# EAGLE board Main (EAGLE 8.0.2)
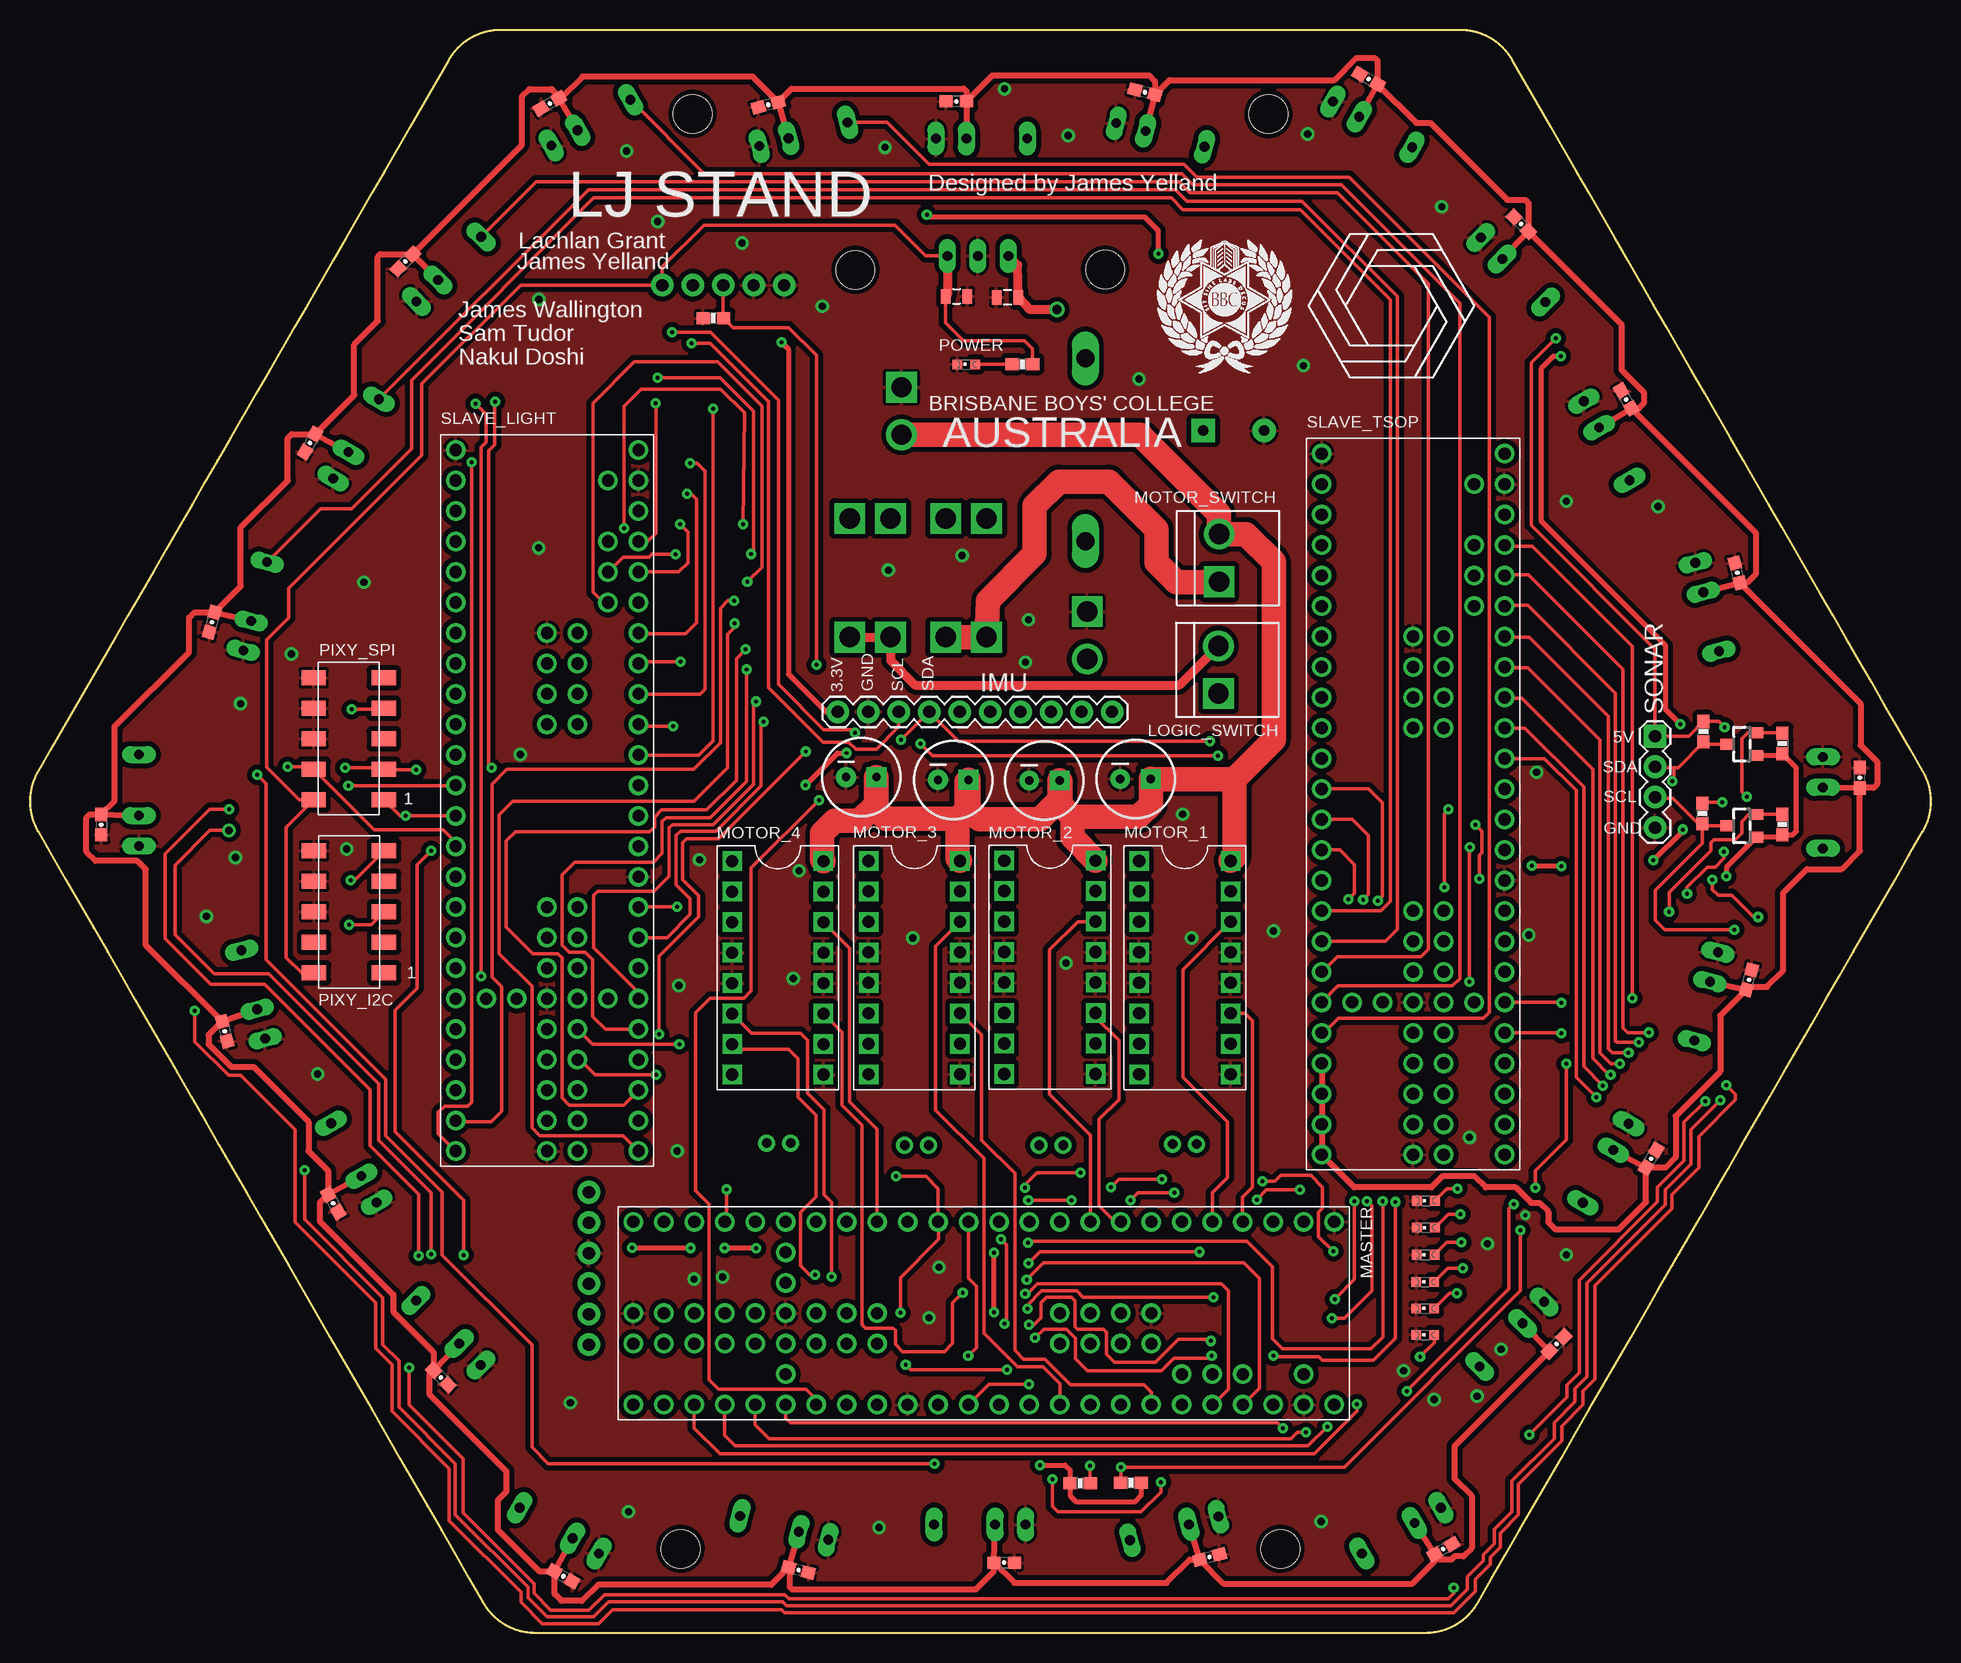
[diagram p3: board, top side]
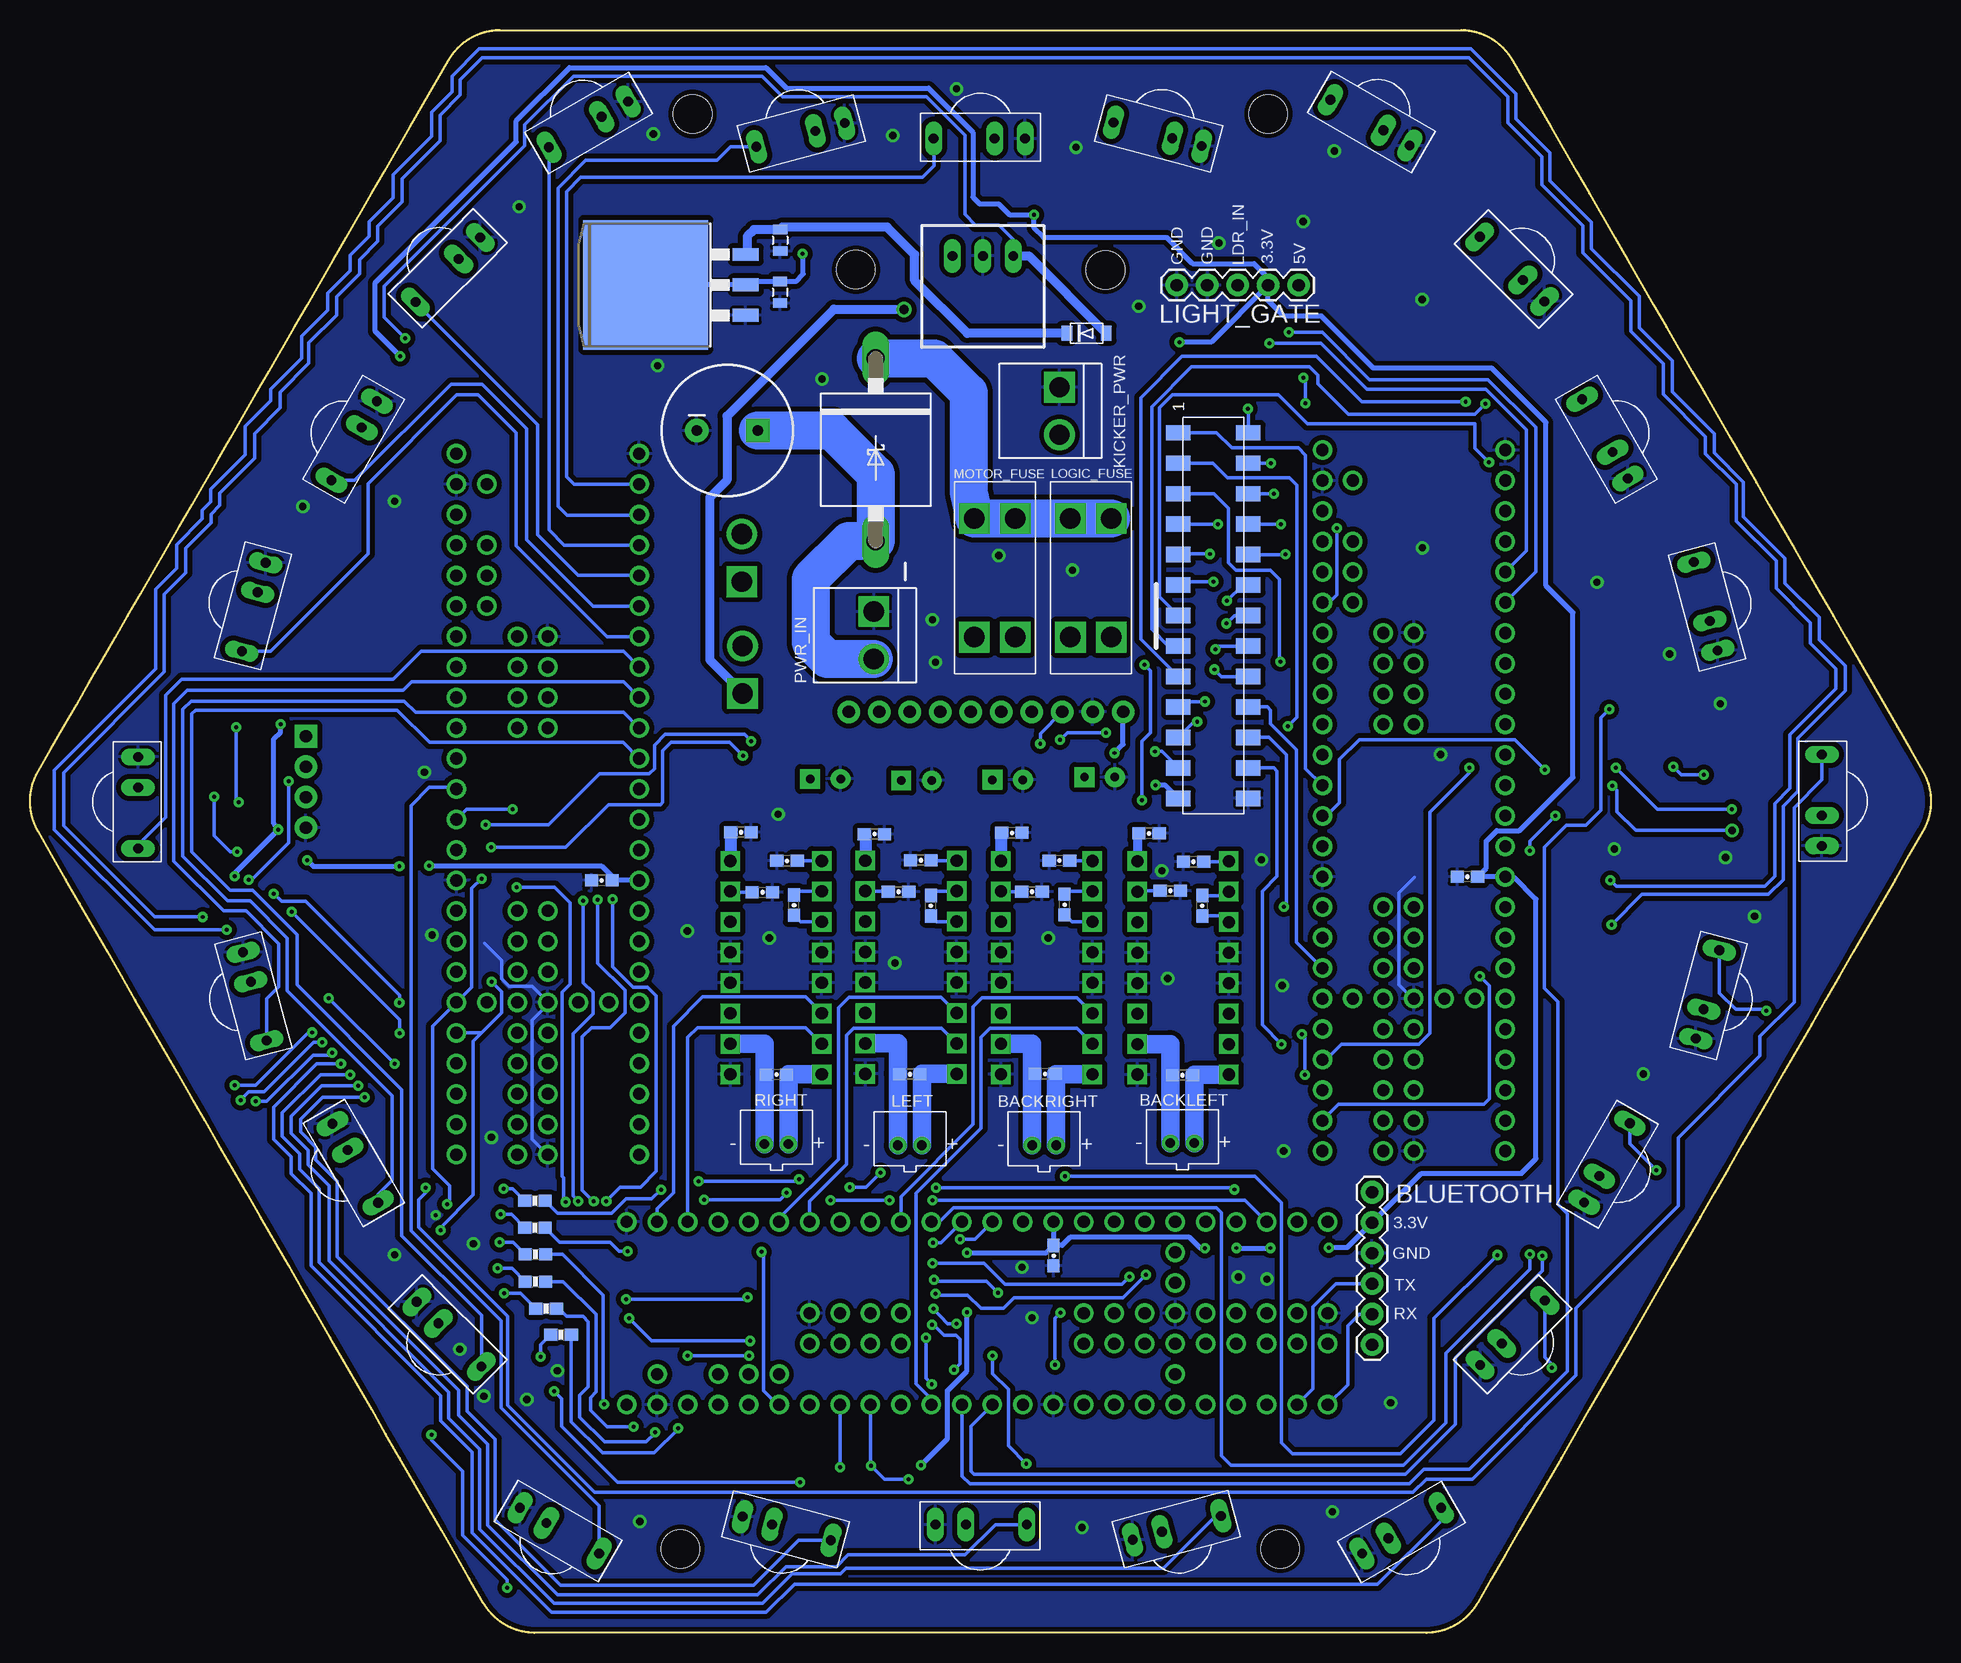
[diagram p4: board, bottom side, seen from below]

Size 158.45 x 133.56 mm. Coordinates in mm from the lower left corner, seen from the top.
Outline: 639 segments
Copper layers (1*16): Top 0.035mm / dielectric 1.5mm / Bottom 0.035mm
Design rules "SparkFun *": minimum track width 6mil, minimum drill 12mil, track to track 8mil, track to pad 8mil, pad to pad 8mil, via to via 8mil, smd to smd 8mil, copper to edge 10mil, drill to drill 8mil, minimum pad ring 12mil, minimum via ring 10mil, stop-mask expansion 4mil, vias tented up to drill 25mil, thermal gap 10mil
Holes 3.2 mm at 54.23,6.99 104.23,6.99 55.23,126.58 103.23,126.56 89.61,113.6 68.81,113.57

## Footprints (pad centres in the part's own frame; a part is rotated, then mirrored left to right if it is on the bottom)
TSOP17XX = drill 0.813 long: GND -3.81,0; OUT 3.81,0; V+ -1.27,0
JST-PH-2-THM = drill 0.8 pad 1.422: 1 1,0; 2 -1,0
1X06 = drill 1.016 pad 1.88: 1 0,0; 2 2.54,0; 3 5.08,0; 4 7.62,0; 5 10.16,0; 6 12.7,0
CPOL-RADIAL-1000UF-25V = drill 0.9 pad 1.93 square: + 2.54,0 | drill 0.9 pad 1.93: - -2.54,0
CPOL-RADIAL-100UF-25V = drill 0.7 pad 1.651 square: 1 1.27,0 | drill 0.7 pad 1.651: 2 -1.27,0
0603-CAP = smd 1.1 x 1: 1 -0.85,0; 2 0.85,0
0805 = smd 0.8 x 1.2: 1 -0.9,0; 2 0.9,0
P6T15 = drill 1.499 long: A 7.62,0; C -7.62,0
SOD-123FL = smd 0.91 x 1.22: A 1.637,0; C -1.637,0
1X10 = drill 1.016 pad 1.88: 1 0,0; 2 2.54,0; 3 5.08,0; 4 7.62,0; 5 10.16,0; 6 12.7,0; 7 15.24,0; 8 17.78,0; 9 20.32,0; 10 22.86,0
B2P-VH = drill 1.7 square: 1 -1.98,0 | drill 1.7: 2 1.98,0
CHIPLED_0603 = smd 0.8 x 0.8: A 0,-0.75; C 0,0.75
1X05 = drill 1.016 pad 1.88: 1 0,0; 2 2.54,0; 3 5.08,0; 4 7.62,0; 5 10.16,0
2X13_SMT = smd 1.27 x 2.032: 1 -15.24,-2.921; 2 -15.24,2.921; 3 -12.7,-2.921; 4 -12.7,2.921; 5 -10.16,-2.921; 6 -10.16,2.921; 7 -7.62,-2.921; 8 -7.62,2.921; 9 -5.08,-2.921; 10 -5.08,2.921; 11 -2.54,-2.921; 12 -2.54,2.921; 13 0,-2.921; 14 0,2.921; 15 2.54,-2.921; 16 2.54,2.921; 17 5.08,-2.921; 18 5.08,2.921; 19 7.62,-2.921; 20 7.62,2.921; 21 10.16,-2.921; 22 10.16,2.921; 23 12.7,-2.921; 24 12.7,2.921; 25 15.24,-2.921; 26 15.24,2.921
3568-FUSEHOLDER = drill 1.702 square: 1 0,3.404; 2 0,0; 3 9.906,0; 4 9.906,3.404
TEENSY-3.5 = drill 1.016: 0 -7.62,26.67; 1 -7.62,24.13; 2 -7.62,21.59; 3 -7.62,19.05; 3.3V -7.62,-6.35; 3.3V-1 7.62,24.13; 3.3V-2 2.54,-29.21; 3.3V-3 -2.54,-16.51; 4 -7.62,16.51; 5 -7.62,13.97; 6 -7.62,11.43; 7 -7.62,8.89; 8 -7.62,6.35; 9 -7.62,3.81; 10 -7.62,1.27; 11 -7.62,-1.27; 12 -7.62,-3.81; 13 7.62,-3.81; 14 7.62,-1.27; 15 7.62,1.27; 16 7.62,3.81; 17 7.62,6.35; 18 7.62,8.89; 19 7.62,11.43; 20 7.62,13.97; 21 7.62,16.51; 22 7.62,19.05; 23 7.62,21.59; 24 -7.62,-8.89; 25 -7.62,-11.43; 26 -7.62,-13.97; 27 -7.62,-16.51; 28 -7.62,-19.05; 29 -7.62,-21.59; 30 -7.62,-24.13; 31 -7.62,-26.67; 32 -7.62,-29.21; 33 7.62,-29.21; 34 7.62,-26.67; 35 7.62,-24.13; 36 7.62,-21.59; 37 7.62,-19.05; 38 7.62,-16.51; 39 7.62,-13.97; 40 0,-8.89; 41 0,-11.43; 42 0,-13.97; 43 0,-19.05; 44 0,-21.59; 45 0,-24.13; 46 0,-26.67; 47 2.54,-26.67; 48 2.54,-24.13; 49 2.54,-21.59; 50 2.54,-19.05; 51 2.54,-13.97; 52 2.54,-11.43; 53 2.54,-8.89; 54 2.54,6.35; 55 2.54,8.89; 56 2.54,11.43; 57 2.54,13.97; A10 5.08,19.05; A11 5.08,16.51; AGND 7.62,26.67; AREF 5.08,21.59; DA0 7.62,-11.43; DA1 7.62,-8.89; DC 0,8.89; DD 0,6.35; DE 0,11.43; GND -7.62,29.21; GND-1 7.62,-6.35; GND-2 0,-29.21; GND-3 0,-16.51; GND-4 0,13.97; PRGRM 2.54,-16.51; RESET 5.08,-16.51; VBAT -5.08,-16.51; VIN 7.62,29.21; VUSB 5.08,26.67
TB6549PG = drill 1.016 square: 1 -3.81,8.89; 2 -3.81,6.35; 3 -3.81,3.81; 4 -3.81,1.27; 5 -3.81,-1.27; 6 -3.81,-3.81; 7 -3.81,-6.35; 8 -3.81,-8.89; 9 3.81,-8.89; 10 3.81,-6.35; 11 3.81,-3.81; 12 3.81,-1.27; 13 3.81,1.27; 14 3.81,3.81; 15 3.81,6.35; 16 3.81,8.89
2X05_SMT = smd 1.27 x 2.032: 1 -5.08,-2.921; 2 -5.08,2.921; 3 -2.54,-2.921; 4 -2.54,2.921; 5 0,-2.921; 6 0,2.921; 7 2.54,-2.921; 8 2.54,2.921; 9 5.08,-2.921; 10 5.08,2.921
0603-RES = smd 1.1 x 1: 1 -0.85,0; 2 0.85,0
SOT23 = smd 0.9 x 1.2: 1 -0.95,-1.2; 2 0.95,-1.2; 3 0,1.2
1X04 = drill 1.016 pad 1.88 square: 1 0,0 | drill 1.016 pad 1.88: 2 2.54,0; 3 5.08,0; 4 7.62,0
TO263-3 = smd 1.067 x 2.159: 1 -2.54,-5.791; 2 0,-5.791; 3 2.54,-5.791 | smd 10.8 x 10.41: TAB 0,2.54
V78-2000 = drill 0.8 long: 1 -2.54,0; 2 0,0; 3 2.54,0

## Placement (x,y rotation side)
0  TSOP1737  [TSOP17XX]  79.32,124.52 180 bottom
1  TSOP1737  [TSOP17XX]  94.22,124.82 195 bottom
2  TSOP1737  [TSOP17XX]  111.9,125.7 210 bottom
3  TSOP1737  [TSOP17XX]  123.62,113.58 225 bottom
4  TSOP1737  [TSOP17XX]  131.43,99.33 240 bottom
5  TSOP1737  [TSOP17XX]  139.8,85.48 255 bottom
6  TSOP1737  [TSOP17XX]  149.44,69.17 270 bottom
7  TSOP1737  [TSOP17XX]  139.71,53.03 285 bottom
8  TSOP1737  [TSOP17XX]  131.34,39.12 300 bottom
9  TSOP1737  [TSOP17XX]  123.52,24.89 315 bottom
10  TSOP1737  [TSOP17XX]  114.31,8.52 330 bottom
11  TSOP1737  [TSOP17XX]  95.38,8.7 345 bottom
12  TSOP1737  [TSOP17XX]  79.17,9.01 0 bottom
13  TSOP1737  [TSOP17XX]  62.86,8.75 15 bottom
14  TSOP1737  [TSOP17XX]  44.12,8.52 30 bottom
15  TSOP1737  [TSOP17XX]  34.87,25 45 bottom
16  TSOP1737  [TSOP17XX]  27,39.16 60 bottom
17  TSOP1737  [TSOP17XX]  18.62,53.2 75 bottom
18  TSOP1737  [TSOP17XX]  9.09,69.38 90 bottom
19  TSOP1737  [TSOP17XX]  18.77,85.54 105 bottom
20  TSOP1737  [TSOP17XX]  27.18,99.49 120 bottom
21  TSOP1737  [TSOP17XX]  34.91,113.64 135 bottom
22  TSOP1737  [TSOP17XX]  46.75,125.84 150 bottom
23  TSOP1737  [TSOP17XX]  64.46,124.87 165 bottom
BACKLEFT  PH  [JST-PH-2-THM]  62.41,40.8 0 bottom
BACKRIGHT  PH  [JST-PH-2-THM]  73.91,40.62 0 bottom
BLUETOOTH  [1X06]  46.58,36.71 270 bottom
C1  1000uF  [CPOL-RADIAL-1000UF-25V]  100.33,100.19 0 bottom
C2  100uF  [CPOL-RADIAL-100UF-25V]  92.15,71.15 0 top
C3  0.1uF  [0603-CAP]  77.22,127.62 180 top
C4  0.1uF  [0603-CAP]  92.94,128.38 165 top
C5  0.1uF  [0603-CAP]  111.58,129.47 150 top
C6  0.1uF  [0603-CAP]  124.31,117.38 135 top
C7  0.1uF  [0603-CAP]  133.04,102.78 120 top
C8  0.1uF  [0603-CAP]  142.32,88.32 105 top
C9  0.1uF  [0603-CAP]  152.53,71.26 90 top
C10  0.1uF  [0603-CAP]  143.28,54.42 75 top
C11  10uF  [0805]  81.48,111.29 180 top
C12  22uF  [0805]  77.24,111.36 0 top
C13  10uF  [0805]  95.92,116.04 270 bottom
C14  10uF  [0805]  95.93,111.7 270 bottom
C15  0.1uF  [0603-CAP]  73.13,31.43 270 bottom
C16  0.1uF  [0603-CAP]  25.27,35.8 300 top
C17  0.1uF  [0603-CAP]  16.23,50.12 285 top
C18  0.1uF  [0603-CAP]  5.94,67.34 270 top
C19  0.1uF  [0603-CAP]  15.16,84.21 255 top
C20  0.1uF  [0603-CAP]  23.34,99.14 240 top
C21  0.1uF  [0603-CAP]  31.29,114.28 225 top
C22  0.1uF  [0603-CAP]  43.33,127.44 210 top
C23  0.1uF  [0603-CAP]  61.54,127.34 195 top
C24  0.1uF  [0603-CAP]  96.24,46.52 180 bottom
C25  0.01uF  [0603-CAP]  94.77,60.64 90 bottom
C26  0.22uF  [0603-CAP]  95.35,64.32 180 bottom
C27  1uF  [0603-CAP]  97.41,61.7 0 bottom
C28  100uF  [CPOL-RADIAL-100UF-25V]  84.56,71.03 0 top
C29  0.1uF  [0603-CAP]  85.12,46.54 180 bottom
C30  0.01uF  [0603-CAP]  83.36,60.59 90 bottom
C31  0.22uF  [0603-CAP]  84.2,64.37 180 bottom
C32  1uF  [0603-CAP]  86.05,61.76 0 bottom
C33  0.1uF  [0603-CAP]  88.06,66.56 180 bottom
C34  0.1uF  [0603-CAP]  73.84,46.57 180 bottom
C35  0.01uF  [0603-CAP]  72.21,60.69 90 bottom
C36  0.22uF  [0603-CAP]  72.64,64.35 180 bottom
C37  100uF  [CPOL-RADIAL-100UF-25V]  76.96,71.08 0 top
C38  0.1uF  [0603-CAP]  110.79,62.7 180 bottom
C39  0.1uF  [0603-CAP]  38.63,63 180 bottom
C40  0.1uF  [0603-CAP]  135.13,39.51 60 top
C41  0.1uF  [0603-CAP]  127.25,24.06 45 top
C42  0.1uF  [0603-CAP]  117.8,6.97 30 top
C43  0.1uF  [0603-CAP]  98.32,6.31 15 top
C44  0.1uF  [0603-CAP]  81.2,5.85 0 top
C45  0.1uF  [0603-CAP]  64.06,5.24 345 top
C46  0.1uF  [0603-CAP]  44.45,4.71 330 top
C47  0.1uF  [0603-CAP]  34.24,21.27 315 top
C48  1uF  [0603-CAP]  74.93,61.76 0 bottom
C49  0.1uF  [0603-CAP]  62.38,46.46 180 bottom
C50  0.01uF  [0603-CAP]  60.73,60.59 90 bottom
C51  0.22uF  [0603-CAP]  61.47,64.24 180 bottom
C52  0.1uF  [0603-CAP]  76.61,66.66 180 bottom
C53  0.1uF  [0603-CAP]  99.19,66.71 180 bottom
C54  100uF  [CPOL-RADIAL-100UF-25V]  69.29,71.31 0 top
C55  1uF  [0603-CAP]  63.4,61.83 0 bottom
C56  0.1uF  [0603-CAP]  65.18,66.61 180 bottom
D1  [P6T15]  87.96,98.59 270 bottom
D2  [SOD-123FL]  70.38,108.29 0 bottom
IMU  [1X10]  67.34,76.74 0 top
KICKER_PWR  VH  [B2P-VH]  72.64,101.81 270 bottom
LED1  RED  [CHIPLED_0603]  116.31,24.82 90 top
LED2  GREEN  [CHIPLED_0603]  116.31,27.03 90 top
LED3  BLUE  [CHIPLED_0603]  116.31,29.24 90 top
LED4  YELLOW  [CHIPLED_0603]  116.33,31.5 90 top
LED5  WHITE  [CHIPLED_0603]  116.36,33.76 90 top
LED6  ORANGE  [CHIPLED_0603]  116.36,36 90 top
LEFT  PH  [JST-PH-2-THM]  85.12,40.62 0 bottom
LIGHT_GATE  [1X05]  52.7,112.3 180 bottom
LIGHT_SENSOR_CONNECTOR  [2X13_SMT]  59.82,84.77 270 bottom
LOGIC_FUSE  2A  [3568-FUSEHOLDER]  71.73,92.87 270 bottom
LOGIC_SWITCH  VH  [B2P-VH]  99.06,80.25 90 top
MASTER  TEENSY-3.5  [TEENSY-3.5]  79.5,26.63 270 top
MOTOR_1  TB6549PG  [TB6549PG]  96.27,55.43 0 top
MOTOR_2  TB6549PG  [TB6549PG]  85.01,55.46 0 top
MOTOR_3  TB6549PG  [TB6549PG]  73.71,55.43 0 top
MOTOR_4  TB6549PG  [TB6549PG]  62.33,55.41 0 top
MOTOR_FUSE  7.5A  [3568-FUSEHOLDER]  79.73,92.87 270 bottom
MOTOR_SWITCH  VH  [B2P-VH]  99.11,89.57 90 top
PIXY_I2C  [2X05_SMT]  26.59,60.08 90 top
PIXY_SPI  [2X05_SMT]  26.57,74.51 90 top
POWER  BLUE  [CHIPLED_0603]  78.05,105.7 90 top
PWR_IN  VH  [B2P-VH]  88.11,83.12 270 bottom
R1  4.7K  [0603-RES]  91.77,12.51 0 top
R2  4.7K  [0603-RES]  87.53,12.45 180 top
R3  330  [0603-RES]  116.36,33.76 0 bottom
R4  330  [0603-RES]  116.36,36 0 bottom
R5  10K  [0603-RES]  146.08,74.1 270 top
R6  10K  [0603-RES]  139.5,75.09 90 top
R7  10K  [0603-RES]  146.08,67.34 270 top
R8  10K  [0603-RES]  139.39,68.26 90 top
R9  10K  [0603-RES]  56.97,109.56 0 top
R17  330  [0603-RES]  82.73,105.72 0 top
R18  330  [0603-RES]  114.19,24.84 0 bottom
R19  330  [0603-RES]  115.43,27.02 0 bottom
R20  330  [0603-RES]  116.33,29.27 0 bottom
R21  330  [0603-RES]  116.33,31.53 0 bottom
RIGHT  PH  [JST-PH-2-THM]  96.24,40.72 0 bottom
SCL  BSS138  [SOT23]  142.7,67.24 90 top
SDA  BSS138  [SOT23]  142.7,74.05 90 top
SLAVE_LIGHT  TEENSY-3.5  [TEENSY-3.5]  43.1,69.35 0 top
SLAVE_TSOP  TEENSY-3.5  [TEENSY-3.5]  115.29,69.05 0 top
SONAR  [1X04]  135.46,74.71 270 top
VREG-3.3V  LM1084  [TO263-3]  104.59,112.32 90 bottom
VREG-5V  V78-2000  [V78-2000]  79.02,114.74 0 bottom

## Tracks (layer width: path | path; a pad name or v marks a point on that pad's centre or on a via)
+3V3  (via drill 0.33)
  Top 0.406: SDA.1 145.92,73.1 R5.2 147.24,72.08 147.24,66.79 146.95,66.49 R7.2 145.87,66.29 SCL.1 141.4,63.8 v141.4,63.03 | R1.2 92.62,11.45 92.05,10.88 87.25,10.88 86.74,11.39 86.74,12.39 R2.2 86.69,12.47 86.69,13.57 86.28,13.98 v84.18,13.98 | v137.57,75.7 136.35,76.92 136.35,82.25 125.98,92.62 125.98,105.37 127,106.38 v127.61,106.38 | v62.64,107.55 63.22,106.97 63.22,79.87 66.34,76.74 IMU.1 | v80.37,26.7 v80.37,31.68 | v64.64,70.65 67.31,73.31 v68.05,73.31 | v60.53,32.04 57.91,32.04 v57.89,32.06 | v127.66,63.89 125.22,63.89 v125.2,63.91 | v135.33,64.37 137.77,66.81 v137.77,66.94 | v50.19,32.09 55.04,32.09 v55.07,32.06 | v94.06,114.92 94.06,116.85 92.94,117.97 74.95,117.97 v74.75,118.17
  Bottom 0.406: MASTER.3.3V C15.1 | SLAVE_TSOP.3.3V C38.1 109.94,63.04 110.82,63.91 v125.2,63.91 | v127.61,106.38 129.67,108.44 129.67,112.51 117.93,124.24 117.93,125.99 113.49,130.44 97.1,130.44 95.38,128.71 83.54,128.71 79.86,125.03 79.86,119.64 79.3,119.08 77.72,119.08 76.81,118.17 v74.75,118.17 74.75,117.05 73.99,116.29 63.73,116.29 61.54,114.11 56.41,114.11 55.24,112.94 LIGHT_GATE.2 | LIGHT_GATE.2 59.99,107.55 v62.64,107.55 | v135.33,64.37 134.82,63.86 127.69,63.86 v127.66,63.89 | v84.18,13.98 81.99,16.16 81.99,20.18 80.37,21.8 v80.37,26.7 | C15.1 72.43,32.28 71.75,32.95 61.8,32.95 60.88,32.04 v60.53,32.04 | LIGHT_SENSOR_CONNECTOR.25 63.86,70.65 v64.64,70.65 | v68.05,73.31 67.33,74.02 IMU.1 | LIGHT_GATE.2 55.24,111.03 53.92,109.71 50.8,109.71 46.48,105.39 36.6,105.39 32.08,100.87 32.08,87.26 29.84,85.02 29.84,71.28 34.29,66.84 36.19,66.84 37.06,65.97 37.06,63.73 C39.1 SLAVE_LIGHT.3.3V 34.77,63 32.92,61.15 32.92,39.51 34.14,38.29 42.47,38.29 BLUETOOTH.2 48.67,32.09 v50.19,32.09 | v57.89,32.06 v55.07,32.06 | v137.57,75.7 137.57,75.04 138.12,74.48 138.12,67.42 137.77,67.06 v137.77,66.94 141.4,63.31 v141.4,63.03 | VREG-3.3V.TAB VREG-3.3V.2 98.52,112.6 C14.1 94.62,112.6 94,113.22 94,114.87 v94.06,114.92 | v80.37,31.68 73.72,31.68 C15.1
+5V  (via drill 0.33)
  Top 0.305: v141.25,75.47 140.78,75.94 R6.2 138.27,74.71 SONAR.1 135.46,81.97 125.15,92.29 125.15,105.85 v127.18,107.88 | v141.05,69.2 139.48,69.2 R8.2 | VREG-5V.3 74.65,114.74 72.08,117.31 56.18,117.31 52.7,113.83 LIGHT_GATE.1 40.89,112.3 32.66,104.07 32.66,98.13 21.56,87.03 21.56,84.59 19.74,82.76 19.74,72.14 22.45,69.43 PIXY_SPI.2 21.36,67.14 21.36,56.27 22.63,55 PIXY_I2C.2 | R17.2 83.58,106.98 82.91,107.65 77.83,107.65 76.33,109.15 76.33,111.35 C12.1
  Top 0.762: VREG-5V.3 76.48,111.5 C12.1
  Bottom 0.305: v141.25,75.47 141.25,69.4 v141.05,69.2 | v127.18,107.88 128.93,109.63 128.93,112.2 117.22,123.91 117.22,125.66 113.16,129.73 97.43,129.73 95.71,128 83.72,128 80.52,124.8 80.52,118.19 79.63,117.31 77.7,117.31 76.48,116.09 VREG-5V.3
  Bottom 0.762: 68.75,108.25 D2.A 75.2,114.74 VREG-5V.3
BT_RX
  Bottom 0.305: MASTER.33 48.62,20.68 48.62,25.59 47.65,26.55 BLUETOOTH.5
BT_TX
  Bottom 0.305: MASTER.34 51.51,20.33 51.51,27.16 49.58,29.09 BLUETOOTH.4
CS_LIGHT  (via drill 0.33, 0.6)
  Top 0.305: v33.43,31.53 33.43,36.66 29.06,41.03 29.06,45.75 19.89,54.92 15.34,54.92 12.09,58.17 12.09,63.97 14.99,66.86 v16.59,66.86 | v26.54,70.6 35.46,70.6 SLAVE_LIGHT.10
  Bottom 0.305: MASTER.9 82.65,34.25 81.48,35.42 59.56,35.42 59.16,35.01 59.16,14.74 58.37,13.95 43.97,13.95 40.44,17.48 40.44,23.3 33.43,30.31 v33.43,31.53 | v26.54,70.6 26.16,70.21 26.16,68.44 24.59,66.86 v16.59,66.86
CS_PIXY  (via drill 0.33)
  Top 0.305: v26.82,76.95 29.39,76.95 PIXY_SPI.7
  Bottom 0.305: MASTER.15 80.77,13.06 80.11,12.4 43.48,12.4 42.27,13.62 38.48,13.62 30.3,21.8 30.3,34.93 31.09,35.72 31.09,52.59 32.21,53.7 32.21,65.46 30.38,67.29 28.75,67.29 27.51,68.54 27.51,76.26 v26.82,76.95
CS_TSOP  (via drill 0.33)
  Top 0.305: SLAVE_TSOP.10 111.58,70.32 112.72,69.17 112.72,61.37 v112.34,60.99 | v112.75,35.97 112.75,24.65 111.76,23.66 104.39,23.66 103.56,24.49 103.56,30.51 101.45,32.62 83.31,32.62 v83.18,32.5
  Bottom 0.305: v112.34,60.99 112.34,54.19 111.53,53.37 111.53,51.57 113.18,49.92 113.18,36.41 v112.75,35.97 | v83.18,32.5 82.52,32.5 MASTER.10
GND  (via drill 0.33, 0.6)
  Top 0.305: C8.2 142.08,89.16
  Top 0.762: VREG-5V.2 78.97,114.74 78.94,114.71
  Bottom 0.305: SLAVE_LIGHT.GND-3 43.2,52.84 44.35,53.98 44.35,61.68 43.05,62.98 | SLAVE_TSOP.GND-1 122.78,62.7 | SLAVE_TSOP.GND-3 115.29,52.56 115.21,52.64 | 115.21,52.64 115.21,52.43 116.59,51.06 116.59,41.13 SLAVE_TSOP.GND-2 | 115.21,52.64 115.37,52.64 116.59,53.86 118.52,53.86 119.15,54.49 119.15,56.04 120.57,57.46
  other vias: 21.79,81.57 17.55,77.43 125.58,71.71 119.99,41.28 81.23,128.66 75.77,30.46 74.93,26.25 55.35,29.47 57.73,29.65 121.49,32.42 120.62,19.72 124.64,34.78 55.8,64.42 54.08,53.93 40.87,73.19 59.36,115.81 26.39,65.31 117.04,19.44 114.5,21.83 122.63,23.63 86.54,124.77 83.24,84.41 71.55,88.55 106.15,105.6 92.43,104.48 66.04,110.55 77.7,89.77 82.98,80.88 117.68,118.83 135.71,93.86 103.66,58.48 45.03,19.16 49.89,10.09 70.76,8.77 107.62,9.28 23.98,46.57 42.39,90.41 106.5,124.9 27.84,87.54 53.95,40.14 63.63,54.52 64.11,63.51 96.09,68.21 73.58,57.89 86.36,55.81 96.82,57.89 128.07,94.29 42.42,111.11 52.32,117.61 49.73,123.48 71.27,123.78 128.07,31.5 14.71,59.7 17.12,64.6 124.94,58.15
  pour Bottom (isolate 0.406): -8.66,67.85 36.55,-6.6 124.15,-7.31 168.17,66.68 126.72,140.44 31.19,139.99 -8.66,70.19
  pour Top (isolate 0.406): 34.8,138.9 -7.39,69.3 34.8,-8.15 126.59,-8.15 167.89,69.3 125.07,140.42
LED1  (via drill 0.33)
  Top 0.305: MASTER.38 62.99,17.89 63.4,17.48 103.99,17.48 v104.44,17.03
  Bottom 0.305: v104.44,17.03 104.44,16.98 106.43,14.99 110.74,14.99 113.33,17.59 R18.2
LED2  (via drill 0.33)
  Top 0.305: MASTER.37 60.45,17.33 61.62,16.16 105.1,16.16 105.64,16.7 v106.35,16.7
  Bottom 0.305: v106.35,16.7 106.35,16.65 107.09,15.91 110.57,15.91 112.62,17.97 112.62,19.8 111.91,20.51 111.91,25.92 112.37,26.37 113.72,26.37 114.35,27.01 R19.2
LED3  (via drill 0.33)
  Top 0.305: v108.13,17.18 106.53,15.58 58.78,15.58 57.91,16.44 MASTER.36
  Bottom 0.305: v108.13,17.18 110.36,17.18 111.73,18.55 111.73,19.59 111.25,20.07 111.25,26.53 113.99,29.27 R20.2
LED4  (via drill 0.33)
  Top 0.305: MASTER.35 55.37,17.05 57.51,14.92 107.06,14.92 110.62,18.47 v110.62,19.03
  Bottom 0.305: R21.2 114.07,31.53 110.67,28.13 110.67,19.08 v110.62,19.03
LED5  (via drill 0.33)
  Top 0.305: v58.06,36.94 58.06,34.4 MASTER.29 | v87.55,38.34 83.92,38.34 82.93,37.35 v82.93,37.09 | v90.12,37.14 90.75,37.78 v94.36,37.78 | v108.64,31.78 107.42,33 107.42,35.06 107.75,35.39 107.75,37.12 106.76,38.11 104.27,38.11 103.78,37.63 v102.72,37.63
  Bottom 0.305: v87.55,38.34 88.75,37.14 v90.12,37.14 | v94.36,37.78 94.51,37.63 v102.72,37.63 | v108.64,31.78 109.35,31.78 110.11,32.55 114.29,32.55 R3.2 | 58.14,37.02 v58.06,36.94 58.22,37.09 v82.93,37.09
LED6  (via drill 0.33)
  Top 0.305: v105.87,36.91 103.07,36.91 v102.26,36.1 | v95.38,36.66 92.35,36.66 v91.72,36.03 | v86.82,36.03 83.24,36.03 v83.21,36.05
  Bottom 0.305: v105.87,36.91 106.63,36.15 108.76,36.15 109.96,34.96 114.47,34.96 R4.2 | v102.26,36.1 95.94,36.1 v95.38,36.66 | v91.72,36.03 v86.82,36.03 | v83.21,36.05 57.17,36.05 MASTER.30
LIGHT_GATE  (via drill 0.33)
  Top 0.305: LIGHT_GATE.3 57.78,109.6 R9.2 58.61,108.77 63.25,108.77 65.56,106.46 v65.56,80.65 | v65.76,69.38 60.12,63.74 60.12,53.5 59.51,52.89 56.69,52.89 55.47,51.67 55.47,36.84 56.59,35.72 56.59,21.09 57.38,20.3 64.67,20.3 65.53,19.44 MASTER.39
  Bottom 0.305: v65.56,80.65 65.07,80.17 65.07,74.99 65.76,74.3 v65.76,69.38
LS0
  Bottom 0.305: LIGHT_SENSOR_CONNECTOR.1 59.54,100.01 58.27,98.74 52.73,98.74 52.12,98.13 52.12,72.02 SLAVE_LIGHT.15
LS1  (via drill 0.33)
  Top 0.305: v56.95,101.99 56.95,74.33 55.73,73.11 50.77,73.11 SLAVE_LIGHT.16
  Bottom 0.305: LIGHT_SENSOR_CONNECTOR.2 56.9,101.94 v56.95,101.99
LS2  (via drill 0.33)
  Top 0.305: v53.59,75.55 50.88,75.55 SLAVE_LIGHT.17
  Bottom 0.305: LIGHT_SENSOR_CONNECTOR.3 59.87,97.47 58.65,96.25 53.47,96.25 52.86,95.64 52.86,76.28 v53.59,75.55
LS3  (via drill 0.33)
  Top 0.305: v55.02,97.47 55.6,97.47 56.29,96.78 56.29,78.65 55.85,78.22 50.75,78.22 SLAVE_LIGHT.18
  Bottom 0.305: LIGHT_SENSOR_CONNECTOR.4 v55.02,97.47
LS4  (via drill 0.33)
  Top 0.305: v54.23,80.93 50.88,80.93 SLAVE_LIGHT.19
  Bottom 0.305: LIGHT_SENSOR_CONNECTOR.5 59.77,94.93 58.55,93.71 58.55,89.16 57.94,88.55 55.07,88.55 54.3,87.79 54.3,81.01 v54.23,80.93
LS5  (via drill 0.33)
  Top 0.305: v54.76,94.93 55.12,94.93 55.57,94.47 55.57,84.18 54.66,83.27 50.77,83.27 SLAVE_LIGHT.20
  Bottom 0.305: LIGHT_SENSOR_CONNECTOR.6 v54.76,94.93
LS6  (via drill 0.33)
  Top 0.305: v59.44,92.39 59.56,101.66 57.58,103.64 50.93,103.64 49.5,102.22 v49.5,92.06
  Bottom 0.305: LIGHT_SENSOR_CONNECTOR.7 v59.44,92.39 | v49.5,92.06 49.5,86.5 50.14,85.86 SLAVE_LIGHT.21
LS7  (via drill 0.33)
  Top 0.305: SLAVE_LIGHT.22 54.05,88.4 54.84,89.19 54.84,91.73 v54.18,92.39
  Bottom 0.305: LIGHT_SENSOR_CONNECTOR.8 v54.18,92.39
LS8  (via drill 0.33)
  Top 0.305: v60.1,89.9 60.32,90.13 60.32,101.79 57.53,104.58 v52.3,104.58 | v52.15,102.45 52.17,102.42 52.17,91.63 51.49,90.94 SLAVE_LIGHT.23
  Bottom 0.305: LIGHT_SENSOR_CONNECTOR.9 62.69,89.9 v60.1,89.9 | v52.3,104.58 52.15,104.43 v52.15,102.45
LS9  (via drill 0.33)
  Top 0.305: v53.82,89.87 51.82,89.87 51.59,89.65 49.43,89.65 SLAVE_LIGHT.A10
  Bottom 0.305: LIGHT_SENSOR_CONNECTOR.10 54,89.85 v53.82,89.87
LS10  (via drill 0.33)
  Top 0.305: v59.79,87.59 61.01,88.81 61.01,102.22 57.33,105.9 50.37,105.9 46.94,102.47 46.94,86.72 47.8,85.86 SLAVE_LIGHT.A11
  Bottom 0.305: LIGHT_SENSOR_CONNECTOR.11 62.46,87.59 v59.79,87.59
LS11  (via drill 0.33)
  Top 0.305: v58.67,85.99 58.17,85.99 57.56,85.38 57.56,74.18 55.32,71.94 39.73,71.94 38.51,70.72 38.51,54.62 39.29,53.83 39.29,43.44 38.46,42.6 35.56,42.6 SLAVE_LIGHT.31
  Bottom 0.305: LIGHT_SENSOR_CONNECTOR.12 57.35,87.31 v58.67,85.99
LS12  (via drill 0.33)
  Top 0.305: SLAVE_LIGHT.32 34.04,41.59 34.04,43.37 34.54,43.87 36.47,43.87 36.83,44.23 v36.83,97.54
  Bottom 0.305: LIGHT_SENSOR_CONNECTOR.13 64.29,86.32 64.29,102.09 63.22,103.16 54.41,103.16 51.99,100.74 38,100.74 38,98.71 v36.83,97.54
LS13  (via drill 0.33)
  Top 0.305: v58.72,84.11 58.72,83.8 58.14,83.22 58.14,72.09 55.35,69.3 40.23,69.3 39.12,68.18 39.12,56.6 41.83,53.88 41.83,42.07 42.49,41.41 49.45,41.41 SLAVE_LIGHT.33
  Bottom 0.305: LIGHT_SENSOR_CONNECTOR.14 58.06,84.77 v58.72,84.11
LS14  (via drill 0.33)
  Top 0.305: v37.62,54.72 37.62,98.79 38.02,99.2 38.02,101.53 v37.13,102.42
  Bottom 0.305: v37.62,54.72 36.8,53.91 36.8,44.48 37.26,44.03 49.4,44.03 50.72,42.71 SLAVE_LIGHT.34 | v37.13,102.42 38.02,101.53 48.54,101.53 51.1,104.1 51.1,104.81 51.79,105.49 61.62,105.49 64.95,102.17 64.95,83.63 63.55,82.23 LIGHT_SENSOR_CONNECTOR.15
LS15  (via drill 0.33)
  Top 0.305: SLAVE_LIGHT.35 49.48,43.98 44.96,43.98 44.35,44.59 44.35,56.24 43.99,56.6 41.91,56.6 39.7,58.81 39.7,66 40.46,66.76 51.66,66.76 52.04,67.14 52.04,67.98 52.65,68.59 56.41,68.59 58.88,71.05 58.88,81.19 v59.64,81.95
  Bottom 0.305: LIGHT_SENSOR_CONNECTOR.16 59.36,82.23 v59.64,81.95
LS16  (via drill 0.33)
  Top 0.305: v38.79,102.6 38.73,102.55 38.73,99.02 38.23,98.51 38.23,72.32 v38.48,72.07
  Bottom 0.305: LIGHT_SENSOR_CONNECTOR.17 65.86,82.81 65.86,102.93 62.43,106.36 51.21,106.36 47.45,102.6 v38.79,102.6 | SLAVE_LIGHT.36 50.42,47.76 49.12,49.06 42.67,49.06 41.78,49.94 41.78,68.36 38.48,71.66 v38.48,72.07
LS17  (via drill 0.33)
  Top 0.305: v59.74,80.27 59.74,70.98 56.69,67.93 53.01,67.93 52.7,67.62 52.7,64.96 51.97,64.22 45.39,64.22 44.35,63.18 44.35,57.31 44.96,56.7 46.28,56.7 46.91,56.07 46.91,51.34 47.98,50.28 50.7,50.28 SLAVE_LIGHT.37
  Bottom 0.305: LIGHT_SENSOR_CONNECTOR.18 59.16,79.69 v59.74,80.27
LS18  (via drill 0.33)
  Top 0.305: v60.53,77.61 60.32,77.4 60.32,70.72 56.95,67.34 53.57,67.34 53.29,67.06 53.29,63.05 52.02,61.78 47.32,61.78 46.99,61.45 46.99,57.08 50.72,53.35 SLAVE_LIGHT.38
  Bottom 0.305: LIGHT_SENSOR_CONNECTOR.19 62.28,77.61 v60.53,77.61
LS19
  Bottom 0.305: LIGHT_SENSOR_CONNECTOR.20 55.32,77.15 55.07,76.89 55.07,75.75 52.88,73.57 52.88,57.54 SLAVE_LIGHT.39
LS20  (via drill 0.33)
  Top 0.305: v61.16,75.93 60.93,75.78 60.93,70.57 57.17,66.81 54.23,66.81 53.87,66.45 53.87,62.34 55.04,61.17 55.04,59.88 53.09,57.92 SLAVE_LIGHT.DA0
  Bottom 0.305: LIGHT_SENSOR_CONNECTOR.21 61.42,75.93 v61.16,75.93
LS21  (via drill 0.33)
  Top 0.305: v53.95,60.51 50.75,60.49 SLAVE_LIGHT.DA1
  Bottom 0.305: LIGHT_SENSOR_CONNECTOR.22 55.17,74.61 53.72,73.16 53.72,60.54 v53.95,60.51
LS22  (via drill 0.33)
  Top 0.305: v64.67,73.44 57.4,66.18 54.74,66.18 54.41,65.85 54.41,62.75 55.73,61.43 55.73,59.67 52.43,56.37 v52.43,49.89 | v52.17,46.49 47.12,46.49 45.85,47.76 SLAVE_LIGHT.49
  Bottom 0.305: LIGHT_SENSOR_CONNECTOR.23 64.11,73.44 v64.67,73.44 | v52.43,49.89 52.17,49.64 v52.17,46.49
LS23  (via drill 0.33)
  Top 0.305: v54.13,49.06 46.89,49.06 SLAVE_LIGHT.50
  Bottom 0.305: LIGHT_SENSOR_CONNECTOR.24 54.76,72.07 54.51,71.81 54.51,63.03 55.73,61.81 55.73,50.66 v54.13,49.06
MISO  (via drill 0.33)
  Top 0.305: PIXY_SPI.1 30.84,68.08 v31.32,68.08 SLAVE_LIGHT.11 | SLAVE_TSOP.11 110.24,67.78 111.56,66.45 111.56,61.53 v111.12,61.1 | v111.45,35.97 111.86,35.57 111.86,28.51 109.55,26.2 v108.51,26.2 | v98.45,24.32 98.3,24.47 95.73,24.47 93.83,22.56 90.4,22.56 89.74,23.22 89.74,25.05 89.48,25.31 87.3,25.31 87.12,25.48 87.12,27.67 86.82,27.97 84.73,27.97 84.28,27.52 84.28,26.25 83.69,25.66 v83.26,25.66 | v81.43,21.93 73.41,21.93 v73,22.34 | v72.57,26.65 72.57,29.6 75.74,32.77 75.74,34.2 MASTER.12 75.69,37.02 74.68,38.03 v72.19,38.03 | v36.14,31.48 36.14,36.05 30.43,41.77 30.43,51.88 32.26,53.7 32.26,63.99 v33.43,65.16
  Bottom 0.305: v111.12,61.1 111.12,55.81 108.86,53.55 108.86,51.67 110.11,50.43 111.66,50.43 112.42,49.67 112.42,36.89 111.51,35.97 v111.45,35.97 | v108.51,26.2 106.63,24.32 v98.45,24.32 | v81.43,21.93 80.95,22.41 80.95,24.44 81.28,24.77 82.24,24.77 83.13,25.66 v83.26,25.66 | v73,22.34 73,26.22 v72.57,26.65 | v36.14,31.48 41.43,26.2 41.43,17.71 44.22,14.92 53.24,14.92 54.15,15.83 54.15,35.85 56.34,38.03 v72.19,38.03 | v33.43,65.16 33.43,65.97 v31.32,68.08
MOSI  (via drill 0.33)
  Top 0.305: SLAVE_LIGHT.12 35.48,65.87 34.44,66.91 28.7,66.91 PIXY_SPI.4 23.44,72.17 v21.49,72.17 | SLAVE_TSOP.12 109.17,65.24 110.39,64.02 110.39,61.63 v109.88,61.12 | v110.41,35.97 110.41,29.45 v108.76,27.8 | v98.65,27.97 87.78,27.97 87.27,28.48 84.33,28.48 83.13,27.29 v83.13,27.01 | v80.92,32.8 81.38,32.34 81.38,25.89 v81.23,25.74 | MASTER.11 78.23,29.55 78.89,28.89 78.89,23.76 v78.21,23.07 | v75.41,14.08 43.2,14.08 41.83,15.45 41.83,23.99 34.34,31.48 34.34,36.71 29.64,41.41 29.64,46.13 19.68,56.09 19.68,70.75 v18.92,71.51
  Bottom 0.305: v109.88,61.12 109.88,55.51 108.18,53.81 106.98,53.81 106.25,53.07 106.25,38.46 107.57,37.14 109.24,37.14 v110.41,35.97 | v108.76,27.8 98.83,27.8 v98.65,27.97 | v80.92,32.8 79.68,32.8 MASTER.11 | v78.21,23.07 78.21,21.6 76.91,20.3 76.91,15.58 v75.41,14.08 | v18.92,71.51 20.83,71.51 v21.49,72.17 | v83.13,27.01 81.97,25.74 v81.23,25.74
MOTOR_PWR
  Top 2.032: 100.38,71.13 103.68,74.43 103.68,89.24 101.37,91.55 MOTOR_SWITCH.2 99.08,91.57 99.08,93.25 92.51,99.83 KICKER_PWR.2 | 100.38,71.13 93.45,71.13 C2.1 93.42,69.02 92.4,68 86.89,68 | 86.89,68 85.9,68.99 85.9,70.95 C28.1 85.83,69.43 84.18,67.78 79.15,67.78 78.08,68.84 78.08,70.93 C37.1 78.23,68.77 77.29,67.83 | 77.29,67.83 71.35,67.83 70.54,68.64 70.54,71.28 C54.1 70.56,69.05 69.16,67.65 67.07,67.65 C56.2 66.03,64.41 MOTOR_4.16 | 77.29,67.83 77.29,64.55 MOTOR_3.16 | 86.89,68 86.89,66.28 MOTOR_2.16 | 100.38,71.13 100.38,64.63 MOTOR_1.16
  Bottom 0.762: C56.2 66.14,66.49 MOTOR_4.16
  Bottom 1.016: C52.2 77.52,66.59 MOTOR_3.16 | C33.2 88.82,66.47 MOTOR_2.16 | C53.2 100.08,66.67 MOTOR_1.16
MTR1_IN1
  Bottom 0.305: MOTOR_1.6 93.83,52.99 102.39,52.99 104.83,50.55 104.83,36.66 106.17,35.31 MASTER.0
MTR1_IN2
  Bottom 0.305: MOTOR_1.7 93.8,50.43 102.82,50.43 103.63,49.61 MASTER.1
MTR1_PWM
  Top 0.305: MOTOR_1.11 101.27,51.62 101.88,51.01 101.88,37.12 101.07,36.31 101.07,34.27 MASTER.2
MTR1_SB
  Top 0.305: MOTOR_1.14 96.09,55.25 96.09,46.31 99.82,42.58 99.82,37.93 98.55,36.66 MASTER.3
MTR2_IN1
  Bottom 0.305: MOTOR_2.6 82.52,52.97 90.17,52.97 91.06,52.08 91.06,39.48 96.01,34.53 MASTER.4
MTR2_IN2
  Bottom 0.305: MASTER.5 93.47,35.97 90.4,39.05 90.4,49.79 89.81,50.38 82.47,50.38 MOTOR_2.7
MTR2_PWM
  Top 0.305: MASTER.6 90.45,34.25 89.1,35.59 89.1,42.78 90.75,44.43 90.75,49.36 88.82,51.29 MOTOR_2.11
MTR2_SB
  Top 0.305: MASTER.7 88.39,41.46 84.99,44.86 84.99,56.9 87.35,59.27 MOTOR_2.14
MTR3_IN1
  Bottom 0.305: MOTOR_3.6 71.2,52.92 79.1,52.92 79.83,52.18 79.83,42.38 85.85,36.36 MASTER.8
MTR3_IN2
  Bottom 0.305: MASTER.16 83.31,19.44 84.61,20.73 84.61,36.61 79.17,42.05 79.17,49.64 78.43,50.38 71.2,50.38 MOTOR_3.7
MTR3_PWM
  Top 0.305: MOTOR_3.11 79.32,49.82 79.32,41.05 82.09,38.29 82.09,23.53 82.83,22.79 84.61,22.79 86.74,20.66 92.86,20.66 93.47,20.05 MASTER.20
MTR3_SB
  Top 0.305: MOTOR_3.14 75.49,57.21 75.49,43.54 79.5,39.53 79.5,24.98 82.3,22.18 84.43,22.18 85.85,20.76 MASTER.17
MTR4_IN1  (via drill 0.33)
  Top 0.305: MOTOR_4.6 60.15,49.97 64.24,49.97 64.82,49.39 64.82,44.97 66.19,43.59 66.19,36.48 66.8,35.87 v66.8,29.68 | v83.24,30.79 84.18,31.73 v97.48,31.73
  Bottom 0.305: v66.8,29.68 67.44,29.04 77.16,29.04 78.92,30.79 v83.24,30.79 | v97.48,31.73 97.31,31.56 97.31,20.18 96.14,19.01 MASTER.21
MTR4_IN2  (via drill 0.33)
  Top 0.305: MOTOR_4.7 58.95,48.62 63.22,48.62 64.01,47.84 64.01,44.64 65.53,43.11 65.53,36.36 64.24,35.06 64.24,30.59 65,29.83 v65.43,29.83 | MASTER.22 98.6,19.01 99.9,20.3 99.9,28.48 99.31,29.07 83.97,29.07 83.16,28.25 v82.96,28.25
  Bottom 0.305: v65.43,29.83 67.33,27.92 76.43,27.92 77.32,27.03 79.2,27.03 80.29,28.13 82.83,28.13 v82.96,28.25
MTR4_PWM  (via drill 0.33)
  Top 0.305: MOTOR_4.11 67.69,50.05 67.69,43.95 69.34,42.3 69.34,25.69 69.65,25.38 71.96,25.38 72.14,25.21 72.14,24.04 72.75,23.43 76.22,23.43 76.91,24.11 76.91,27.49 v77.75,28.33 | MASTER.23 102.46,20.38 102.46,29.52 101.17,30.82 84.48,30.82 v83.08,29.42
  Bottom 0.305: v77.75,28.33 78.71,29.29 82.96,29.29 v83.08,29.42
MTR4_SB
  Top 0.305: MOTOR_4.14 68.3,57.06 68.3,44.26 70.61,41.94 MASTER.24
N$1
  Bottom 0.254: 84.11,46.57 83.72,46.57 83.72,46.47 84.26,46.47 C29.1
  Bottom 1.524: MOTOR_2.8 84.11,46.57 LEFT.1
N$2
  Bottom 0.254: C29.2 86.11,46.54 86.11,46.59
  Bottom 1.524: MOTOR_2.10 86.11,49.11 86.11,46.59 LEFT.2
N$3
  Bottom 0.305: MOTOR_2.2 82.99,61.81 C30.2
N$4
  Bottom 0.305: MOTOR_2.3 82.89,59.27 C30.1
N$5
  Bottom 0.254: C24.1 94.97,46.52 94.97,46.54
  Bottom 1.524: MOTOR_1.8 94.97,46.54 95.24,46.54 RIGHT.1
N$6
  Bottom 0.305: MOTOR_2.1 83.33,64.35 C31.1
N$7
  Bottom 0.254: C24.2 97.24,46.52 97.24,46.64
  Bottom 1.524: MOTOR_1.10 97.24,49.08 97.24,46.64 RIGHT.2
N$8
  Bottom 0.305: C48.1 77.49,61.76 MOTOR_3.15
N$9
  Top 0.762: LOGIC_FUSE.4 LOGIC_FUSE.3 71.73,81.03 73.79,78.98 95.81,78.98 LOGIC_SWITCH.2
N$10
  Bottom 0.305: MOTOR_1.2 94.47,61.78 C25.2
N$11  (via drill 0.76)
  Top 0.762: v85.6,110.27 83.35,110.27 C11.1 82.33,113.97 VREG-5V.1
  Bottom 0.762: LOGIC_SWITCH.1 99.06,78.34 101.8,81.09 101.8,94.6 100.35,96.05 100.35,101.38 91.44,110.3 85.62,110.3 v85.6,110.27
N$12
  Bottom 0.305: MOTOR_1.3 94.22,59.24 C25.1
N$13
  Bottom 0.305: MOTOR_1.1 C26.1
N$14
  Bottom 0.254: C34.1 72.91,46.57 72.91,46.54
  Bottom 1.524: MOTOR_3.8 72.91,46.54 BACKRIGHT.1
N$15
  Bottom 0.305: C27.1 100,61.71 MOTOR_1.15
N$16
  Bottom 0.254: C34.2 74.91,46.57 74.91,46.72
  Bottom 1.524: MOTOR_3.10 74.91,49.08 74.91,46.72 BACKRIGHT.2
N$17
  Bottom 0.305: MOTOR_3.2 71.97,61.78 C35.2
N$18
  Bottom 0.305: MOTOR_3.3 71.61,59.24 C35.1
N$19
  Bottom 0.305: MOTOR_3.1 71.77,64.32 C36.1
N$20
  Bottom 0.305: MOTOR_4.15 66.06,61.83 C55.1
N$21
  Top 2.032: MOTOR_FUSE.4 MOTOR_FUSE.3 79.86,86.01 83.74,89.9 83.74,93.91 85.75,95.92 89.94,95.92 93.9,91.96 93.9,89.21 95.55,87.56 99.08,87.56 MOTOR_SWITCH.1
N$22
  Bottom 0.254: C49.1 60.88,46.47 60.88,46.52
  Bottom 1.524: MOTOR_4.8 60.88,46.52 61.41,46.52 BACKLEFT.1
N$23  (via drill 0.33)
  Top 0.305: LED2.A 118.33,28.3 v118.95,28.3
  Bottom 0.305: R19.1 117.56,28.3 v118.95,28.3
N$24  (via drill 0.33)
  Top 0.305: v119.46,30.36 118.17,30.36 LED3.A
  Bottom 0.305: R20.1 118.27,30.36 v119.46,30.36
N$25  (via drill 0.33)
  Top 0.305: v119.3,32.55 118.12,32.55 LED4.A
  Bottom 0.305: R21.1 118.2,32.55 v119.3,32.55
N$26
  Bottom 0.254: C49.2 63.41,46.47
  Bottom 1.524: MOTOR_4.10 63.41,49.06 63.41,46.47 BACKLEFT.2
N$27
  Top 0.305: POWER.A 81.85,105.7 R17.1
N$28
  Bottom 0.305: MOTOR_4.2 58.84,61.44 C50.2
N$29  (via drill 0.33)
  Top 0.305: v115.87,23 117.06,24.18 LED1.A
  Bottom 0.305: R18.1 115.87,24 v115.87,23
N$30
  Bottom 0.305: MOTOR_4.3 59.04,59.74 C50.1
N$31
  Bottom 0.305: MOTOR_4.1 58.57,64.25 C51.1
N$32
  Bottom 0.305: MOTOR_2.15 86.96,61.81 C32.1
N$33  (via drill 0.33)
  Top 0.305: v119.23,34.88 118.22,34.88 LED5.A
  Bottom 0.305: R3.1 118.32,34.88 v119.23,34.88
N$34  (via drill 0.33)
  Top 0.305: v118.97,37.02 118.12,37.02 LED6.A
  Bottom 0.305: R4.1 118.22,37.02 v118.97,37.02
N$35
  Bottom 2.032: 97.76,100.21 C1.+
  Bottom 3.175: C1.+ 91.59,100.19 87.96,96.55 D1.A 90.22,90.97 93.37,87.82 93.37,82.53 92,81.16 88.14,81.16 PWR_IN.2
N$36
  Bottom 0.762: VREG-3.3V.3 98.68,114.99 98.68,116.37 98.11,116.94 C13.1 95.73,117.13 86.99,117.13 84.71,114.84 84.71,112.68 80.31,108.29 D2.C
PWR
  Bottom 3.175: D1.C 83.08,106.21 80.21,103.34 80.21,95.06 MOTOR_FUSE.2 MOTOR_FUSE.1 LOGIC_FUSE.2 LOGIC_FUSE.1
SCK  (via drill 0.33)
  Top 0.305: v32.18,71.92 29.54,71.92 PIXY_SPI.3 29.39,72.07 v26.26,72.07 | v118.24,68.61 117.88,68.26 v117.88,62.11 | v113.82,35.9 113.82,24.54 111.96,22.69 107.75,22.69 107.44,23 103.73,23 v103.63,23.1 | v83.77,24.57 84.51,25.31 86.38,25.31 87.15,24.54 87.15,22.84 88.14,21.85 94.31,21.85 95.35,22.89 98.3,22.89 v98.5,23.1 | v83.29,20.71 79.93,20.71 MASTER.14 | v32.38,31.4 32.38,36.56 28.37,40.57 28.37,45.25 19.58,54.03 15.06,54.03 11.25,57.84 11.25,64.91 14.96,68.61 v16.61,68.61
  Bottom 0.305: v32.18,71.92 34.7,74.43 47.65,74.43 49.3,72.78 49.3,69.17 50.39,68.08 SLAVE_LIGHT.14 | SLAVE_TSOP.14 122.07,68.61 v118.24,68.61 | v117.88,62.11 114.73,62.11 113.44,60.82 113.44,54.03 114.1,53.37 114.1,38.03 113.97,37.91 113.97,36.05 v113.82,35.9 | v103.63,23.1 v98.5,23.1 | v83.77,24.57 83.77,21.19 v83.29,20.71 | MASTER.14 80.03,17.2 80.03,13.45 79.78,13.19 43.81,13.19 39.65,17.36 39.65,22.92 32.38,30.18 v32.38,31.4 | v26.26,72.07 22.81,68.61 v16.61,68.61
SCL  (via drill 0.33)
  Top 0.305: R7.1 SCL.2 143.27,68.19 142.67,67.6 142.67,66.61 142.16,66.1 140.36,66.1 140.11,65.85 140.11,65.18 136.63,61.71 v136.63,60.08 | R1.1 90.93,12.52 v90.93,13.8 109.55,13.8 124.23,28.48 v124.23,33.54 | v127.63,49.97 127.61,50 SLAVE_TSOP.37 | v120.01,65.46 119.99,65.44 v119.99,54.26 | v55.14,107.45 56.69,107.45 61.57,102.57 61.57,78.75 66.09,74.23 68.25,74.23 68.83,73.64 70.56,73.64 72.41,75.5 IMU.3 | v74.24,74.07 75.23,73.08 v99.03,73.08
  Bottom 0.305: MASTER.19 v90.93,13.8 | SLAVE_LIGHT.3 33.73,90.15 33.73,100.24 37.11,103.62 47.01,103.62 50.85,107.45 v55.14,107.45 | v136.63,60.08 127.63,51.09 v127.63,49.97 | IMU.3 74.24,74.91 v74.24,74.07 | v120.01,65.46 113.79,65.46 110.24,69.02 105.89,69.02 105.71,69.2 105.71,73.52 105.03,74.2 100.15,74.2 v99.03,73.08 | v119.99,54.26 119.13,53.4 119.13,51.67 120.8,50 | 120.8,50 SLAVE_TSOP.37 | 120.8,50 121.51,49.28 121.51,36.48 124.23,33.77 v124.23,33.54
SCL_5V  (via drill 0.33)
  Top 0.305: SCL.3 139.56,67.24 R8.1 | R8.1 139.08,67.41 136.96,69.53 135.56,69.53 SONAR.3 | PIXY_I2C.5 28.45,59.01 v26.62,59.01 | R8.1 139.39,65.79 135.48,61.88 135.48,59.37 136.27,58.58 v142.06,58.58
  Bottom 0.305: v26.62,59.01 24.1,61.53 13.54,61.53 12.32,62.75 12.32,68.89 11.1,70.11 11.1,74.56 7.14,78.52 7.14,80.58 9.32,82.76 9.32,84.62 12.17,87.46 12.17,89.54 15.62,93 15.62,95.89 18.06,98.33 18.06,99.93 21.56,103.44 21.56,106 24.31,108.75 24.31,111.36 28.3,115.35 28.3,117.53 31.75,120.99 31.75,123.33 34.59,126.17 34.59,128.25 38.33,131.99 121.01,131.99 123.27,129.73 123.27,128.43 124.99,126.7 124.99,124.7 128.19,121.5 128.19,119.57 130.17,117.59 130.17,116.37 131.75,114.79 131.75,113.52 133.65,111.62 133.65,110.22 135.81,108.06 135.81,106.21 138.38,103.64 138.38,102.68 140.51,100.54 140.51,98.18 143.38,95.31 143.38,94.27 144.09,93.56 144.09,92.82 146.23,90.69 146.23,88.73 147.98,86.98 147.98,80.32 156.41,71.89 156.41,66.94 148.06,58.58 v142.06,58.58
SDA  (via drill 0.33)
  Top 0.305: R5.1 146.03,75 SDA.2 143.19,75 142.67,74.48 142.67,70.09 v143.1,69.66 | v88.37,13.93 88.37,12.47 R2.1 | v138.12,61.58 138.12,62.11 139.8,63.79 140.46,63.79 141.2,64.52 v141.2,65.08 | v127.66,52.48 127.61,52.54 SLAVE_TSOP.38 | v114.76,20.13 114.76,20.15 123.29,28.69 123.29,35.34 v123.67,35.72 | v94.26,12.56 94.26,11.72 92.61,10.07 85.7,10.07 85.22,10.55 v85.22,12.78 | v53.52,108.36 56.72,108.36 62.38,102.7 62.38,79.05 66.17,75.27 68.53,75.27 v68.78,75.01 | v72.59,74.41 72.62,74.41 IMU.4 77.39,74.3 v98.35,74.3 | v120.8,62.82 120.8,64.78 121.01,64.98 121.01,66.81 v120.47,67.34
  Bottom 0.305: v143.1,69.66 143.1,66.43 141.76,65.08 v141.2,65.08 | MASTER.18 88.39,13.95 v88.37,13.93 87.22,12.78 v85.22,12.78 | SLAVE_LIGHT.4 32.94,88.4 32.94,100.44 36.93,104.43 46.79,104.43 50.72,108.36 v53.52,108.36 | v138.12,61.58 137.49,60.94 135.48,60.94 127.66,53.12 v127.66,52.48 | v120.8,62.82 121.64,62.06 121.64,53.78 122.88,52.54 SLAVE_TSOP.38 124.89,50.55 124.89,38.67 123.49,37.27 123.49,36.08 123.67,35.9 v123.67,35.72 | v114.76,20.13 114.12,19.49 114.12,17.2 109.47,12.56 v94.26,12.56 | v68.78,75.01 71.98,75.01 v72.59,74.41 | v120.47,67.34 115.21,67.34 110.97,71.59 106.83,71.59 106.4,72.02 106.4,73.97 105.51,74.86 98.91,74.86 v98.35,74.3
SDA_5V  (via drill 0.33)
  Top 0.305: SDA.3 139.69,74.05 R6.1 139.5,74.2 137.39,72.09 137.03,72.09 | 137.03,72.09 135.53,72.09 SONAR.2 | PIXY_I2C.9 27.05,62.7 v26.72,62.7 | v136.91,70.95 137.03,71.08 137.03,72.09 | v140.23,62.75 140.23,61.93 140.72,61.45 141.86,61.45 143.66,59.65 v144.04,59.65
  Bottom 0.305: v26.72,62.7 26.24,62.21 13.87,62.21 13.03,63.05 13.03,69.1 11.76,70.37 11.76,74.84 7.92,78.67 7.92,80.32 10.06,82.46 10.06,84.18 12.9,87.03 12.9,89.31 16.23,92.64 16.23,95.69 18.8,98.26 18.8,99.68 22.33,103.21 22.33,105.75 25.02,108.44 25.02,111.01 29.03,115.02 29.03,117.25 32.44,120.66 32.44,123 35.28,125.84 35.28,128 38.53,131.25 120.75,131.25 122.58,129.42 122.58,128.15 124.26,126.48 124.26,124.34 127.43,121.17 127.43,119.26 129.46,117.23 129.46,115.96 130.99,114.44 130.99,113.24 132.89,111.34 132.89,109.81 135.2,107.5 135.2,105.77 137.59,103.39 137.59,102.07 139.72,99.93 139.72,97.87 142.62,94.98 142.62,93.96 143.36,93.23 143.36,92.49 145.49,90.36 145.49,88.32 147.27,86.55 147.27,80.07 155.65,71.69 155.65,67.24 148.06,59.65 v144.04,59.65 | v136.91,70.95 136.91,65.82 139.98,62.75 v140.23,62.75
TSOP0
  Bottom 0.305: SLAVE_TSOP.0 113.11,95.72 113.74,96.35 113.74,120.1 112.55,121.29 84.05,121.29 83.11,122.23 83.11,124.49 0.OUT
TSOP1
  Bottom 0.305: 1.OUT 100.05,123.84 101.19,122.69 112.14,122.69 114.45,120.38 114.45,93.89 113.69,93.12 107.72,93.12 SLAVE_TSOP.1
TSOP2
  Bottom 0.305: 2.OUT 115.2,91.92 113.92,90.64 SLAVE_TSOP.2
TSOP3
  Bottom 0.305: 3.OUT 126.32,110.86 116.13,100.67 116.13,91.5 112.75,88.12 107.7,88.12 SLAVE_TSOP.3
TSOP4
  Bottom 0.305: 4.OUT 131.38,96.04 123.37,104.05 120.78,104.05 117.07,100.34 117.07,91.07 111.53,85.53 107.7,85.53 SLAVE_TSOP.4
TSOP5
  Bottom 0.305: 5.OUT 138.4,81.8 130.28,89.92 130.28,95.77 122.88,103.16 121.08,103.16 117.93,100.01 117.93,90.58 110.36,83.02 SLAVE_TSOP.5
TSOP6
  Bottom 0.305: 6.OUT 149.44,65.65 147.14,67.95 147.14,78.14 145.82,79.46 128.17,79.46 125.83,81.8 108.99,81.8 SLAVE_TSOP.6
TSOP7
  Bottom 0.305: 7.OUT 138.73,52.82 137.72,53.83 137.72,57.44 140.44,60.16 142.32,60.16 146.46,64.3 146.46,77.43 145.34,78.55 127.33,78.55 126.64,79.23 108.97,79.23 SLAVE_TSOP.7
TSOP8
  Bottom 0.305: SLAVE_TSOP.8 108.97,76.69 126.31,76.69 127.25,77.63 145.03,77.63 145.72,76.95 145.72,64.73 141.99,60.99 140.11,60.99 137.01,57.9 137.01,53.5 128.27,44.76 128.27,37.73 129.44,36.56 8.OUT
TSOP9
  Bottom 0.305: 9.OUT 120.83,26.45 127.46,33.08 127.46,45.25 136.19,53.98 136.19,58.17 139.9,61.88 141.76,61.88 144.96,65.08 144.96,76.59 144.65,76.89 127.84,76.89 125.15,74.2 109.02,74.2 SLAVE_TSOP.9
TSOP10
  Bottom 0.305: 10.OUT 111.01,10.59 119.18,18.75 119.18,25.99 126.69,33.51 126.69,68.92 125.17,70.44 123.04,70.44 SLAVE_TSOP.15
TSOP11  (via drill 0.33)
  Top 0.305: SLAVE_TSOP.16 126.24,72.86 128.88,70.21 128.88,46.31 v130.56,44.64
  Bottom 0.305: 11.OUT 94.41,7.71 98.15,3.97 114.22,3.97 119.68,9.43 119.68,16.14 122.02,18.47 122.02,20.53 132.84,31.35 132.84,35.7 132.84,36.23 132.84,37.63 134.62,39.4 134.62,40.47 135.89,41.74 135.89,42.81 134.06,44.64 v130.56,44.64
TSOP12  (via drill 0.33)
  Top 0.305: SLAVE_TSOP.17 124.61,75.4 129.51,70.49 129.51,47.2 v131.11,45.6
  Bottom 0.305: 12.OUT 77.99,9.01 80.52,6.49 90.25,6.49 91.24,5.49 95.45,5.49 97.79,3.16 114.48,3.16 120.29,8.97 120.29,15.71 122.73,18.14 122.73,20.23 133.53,31.02 133.53,37.24 135.28,39 135.28,40.19 136.7,41.61 136.7,43.04 134.14,45.6 v131.11,45.6
TSOP13  (via drill 0.33)
  Top 0.305: SLAVE_TSOP.18 122.96,77.88 124.36,77.88 130.28,71.97 130.28,47.86 131.62,46.52 v131.75,46.52
  Bottom 0.305: 13.OUT 59.59,9.73 63.96,5.37 90.45,5.37 90.91,4.91 94.94,4.91 97.41,2.45 114.78,2.45 120.95,8.62 120.95,15.3 123.55,17.89 123.55,20.05 134.37,30.87 134.37,35.11 134.37,35.39 134.37,37.02 135.99,38.64 135.99,39.94 137.41,41.36 137.41,43.34 134.24,46.52 v131.75,46.52
TSOP14  (via drill 0.33)
  Top 0.305: SLAVE_TSOP.19 122.96,80.42 124.87,80.42 130.86,74.43 130.86,48.32 131.77,47.4 v132.54,47.4
  Bottom 0.305: 14.OUT 40.82,9.35 46.13,4.05 94.74,4.05 97.08,1.71 114.96,1.71 121.59,8.34 121.59,15.05 124.23,17.69 124.23,19.77 135.03,30.56 135.03,36.61 136.68,38.26 136.68,39.66 138.15,41.13 138.15,43.8 134.54,47.4 v132.54,47.4
TSOP15  (via drill 0.33)
  Top 0.305: v139.65,44.28 137.87,42.55 137.87,39.35 135.66,37.14 135.66,35.92 129.13,29.4 129.13,21.65 128.12,20.63 128.12,19.62 v124.99,16.49 | SLAVE_TSOP.20 122.99,82.94 124.97,82.94 131.55,76.36 131.55,48.67 131.88,48.34 v133.25,48.34 | v31.61,22.08 31.61,19.02 36.12,14.51 36.12,9.99 42.01,4.1 42.01,3.29 43.41,1.89 46.58,1.89 47.88,3.18 62.92,3.18 63.27,2.83 118.21,2.83 118.67,3.29 v118.67,3.74
  Bottom 0.305: 15.OUT 32.18,22.94 31.61,22.37 v31.61,22.08 | v133.25,48.34 133.45,48.14 134.85,48.14 138.71,44.28 v139.65,44.28 | v124.99,16.49 124.99,16.06 122.38,13.45 122.38,8.14 118.67,4.43 v118.67,3.74
TSOP16  (via drill 0.33)
  Top 0.305: v22.88,38.54 22.88,34.45 29.41,27.92 29.41,24.01 30.76,22.67 30.76,18.78 35.46,14.08 35.46,9.84 41.5,3.79 41.5,2.93 43.1,1.33 46.96,1.33 48.21,2.57 62.74,2.57 63.04,2.27 118.44,2.27 119.81,3.64 119.81,4.66 121.16,6 121.16,6.51 122.05,7.4 122.05,8.62 123.52,10.09 123.52,12.66 127.05,16.19 127.05,17.51 128.78,19.24 128.78,20.35 129.77,21.34 129.77,29.14 136.3,35.67 136.3,36.91 138.43,39.05 138.43,41.92 v140.89,44.38 | SLAVE_TSOP.21 122.96,85.61 124.84,85.61 132.16,78.29 132.16,49.31 132.26,49.21 v134.11,49.21
  Bottom 0.305: 16.OUT 25.09,40.75 v22.88,38.54 | v140.89,44.38 140.89,44.43 140.23,45.09 138.91,45.09 134.8,49.21 v134.11,49.21
TSOP17  (via drill 0.33)
  Top 0.305: v13.74,51.82 13.74,49.26 16.56,46.44 17.58,46.44 22.1,41.92 22.1,34.22 28.8,27.52 28.8,23.71 30.17,22.34 30.17,18.45 34.95,13.67 34.95,9.36 40.92,3.39 40.92,2.55 42.7,0.77 47.4,0.77 48.56,1.94 62.64,1.94 62.89,1.68 118.69,1.68 120.47,3.46 120.47,4.45 121.72,5.7 121.72,6.31 122.55,7.15 122.55,8.31 124.08,9.84 124.08,12.38 127.69,15.99 127.69,17.23 129.44,18.98 129.44,20.13 130.45,21.14 130.45,28.94 136.85,35.34 136.85,36.51 139.09,38.74 139.09,41.33 142.16,44.41 142.16,44.86 v141.4,45.63 | SLAVE_TSOP.22 122.99,88.17 124.89,88.17 132.77,80.3 132.77,50.43 133.17,50.02 v134.95,50.02
  Bottom 0.305: 17.OUT 17.63,53.3 16.28,51.95 13.87,51.95 v13.74,51.82 | v141.4,45.63 139.65,45.63 135.25,50.02 v134.95,50.02
TSOP18  (via drill 0.33)
  Top 0.305: v128.07,47.4 128.07,41.11 125.48,38.51 v125.48,37.09 | v133.55,52.89 133.55,82.23 125.22,90.56 122.99,90.56 SLAVE_TSOP.23
  Bottom 0.305: 18.OUT 9.09,71.08 11.4,68.77 11.4,52.54 14.25,49.69 14.25,48.07 21.06,41.26 21.06,35.57 29.59,27.03 29.59,21.45 38.23,12.81 42.06,12.81 43.18,11.69 111.38,11.69 118.64,18.96 118.64,26.37 126.06,33.79 126.06,36.08 125.48,36.66 v125.48,37.09 | v128.07,47.4 v133.55,52.89
TSOP19
  Top 0.305: 19.OUT 24.22,93.68 26.8,93.68 31.8,98.69 31.8,104.38 46.99,119.57 95.15,119.57 96.11,118.6 105.89,118.6 113.41,111.08 113.41,60.94 112.62,60.16 SLAVE_TSOP.24
TSOP20
  Top 0.305: 20.OUT 46.55,120.25 95.48,120.25 96.42,119.31 106.02,119.31 113.97,111.36 113.97,58.61 112.98,57.62 SLAVE_TSOP.25
TSOP21
  Top 0.305: 21.OUT 42.19,120.91 95.76,120.91 96.67,120 108.99,120 116.56,112.43 116.56,56.98 115.93,56.35 108.99,56.35 107.72,55.08 SLAVE_TSOP.26
TSOP22
  Top 0.305: 22.OUT 56.19,121.6 96.01,121.6 96.95,120.66 109.32,120.66 119.18,110.8 119.18,54.52 118.57,53.91 109.02,53.91 107.67,52.56 SLAVE_TSOP.27
TSOP23
  Top 0.305: 23.OUT 71.45,125.86 74.95,122.36 96.19,122.36 97.26,121.29 109.98,121.29 121.64,109.63 121.64,51.72 121.13,51.21 109.07,51.21 107.85,50 SLAVE_TSOP.28
TSOP_PWR
  Top 0.406: 117.07,6.08 C42.1
  Top 0.508: C47.1 15.V+ | C16.1 16.V+ | C17.1 17.V+ | C18.1 18.V+ | C19.1 19.V+ | C20.1 20.V+ | C21.1 21.V+ | C22.1 22.V+ | C23.1 23.V+ | C3.1 0.V+ | C4.1 1.V+ | C5.1 2.V+ | C6.1 3.V+ | C44.1 12.V+ | C43.1 11.V+ | 10.V+ C42.1 | 9.V+ C41.1 118.74,15.55 118.74,12.84 120.17,11.41 120.17,7.04 119.48,6.36 118.74,6.36 118.49,6.1 117.51,6.1 C42.1 | 8.V+ C40.1 | 7.V+ C10.1 | 6.V+ C9.1 | 5.V+ C8.1 | 4.V+ C7.1 | 13.V+ C45.1 | C46.1 14.V+ | SLAVE_TSOP.29 SLAVE_TSOP.30 SLAVE_TSOP.31 SLAVE_TSOP.32 110.39,37.12 116.81,37.12 117.78,38.08 120.37,38.08 121.34,37.12 123.85,37.12 125.15,35.82 125.83,35.82 126.54,35.11 126.54,34.22 127.15,33.61 132.44,33.61 134.7,35.88 C40.1 | C10.1 140.89,51.43 140.89,46.77 137.18,43.06 137.18,39.61 136.35,38.77 C40.1 | C10.1 143.3,53.83 144.78,53.83 146.13,55.18 146.13,61.65 148.11,63.64 151,63.64 152.53,65.16 C9.1 | C8.1 152.6,77.44 152.6,73.95 153.97,72.58 153.97,70.7 153.68,70.41 C9.1 | C43.1 99.49,4.1 115.24,4.1 117.07,5.93 C42.1 | C44.1 82.06,4.15 94.74,4.15 96.68,6.09 C43.1 | C45.1 63.32,5.38 63.32,3.82 63.52,3.62 78.84,3.62 80.35,5.13 C44.1 | C45.1 61.77,4 47.35,4 46,2.65 44.3,2.65 43.71,3.23 C46.1 | C47.1 33.27,21.51 33.27,19.9 39.7,13.47 39.7,11.77 38.99,11.06 38.99,8.57 42.42,5.13 C46.1 | C16.1 24.15,35.84 24.15,34.3 30.28,28.18 30.28,26.75 33.64,23.39 C47.1 | C17.1 14.88,49.82 14.88,49.06 16.79,47.15 18.64,47.15 23.22,42.58 23.22,40.14 24.85,38.51 C16.1 | C17.1 9.65,57.3 9.65,63.61 8.94,64.32 5.46,64.32 4.7,65.08 4.7,67.93 4.96,68.19 C18.1 | C18.1 7.06,69.31 7.06,75.52 13.26,81.72 13.26,84.59 13.7,85.03 C19.1 | C19.1 17.58,87.22 17.58,92.11 21.49,96.02 21.49,99.55 21.82,99.88 C20.1
  Top 0.508: C20.1 27.03,103.14 27.03,107.37 28.98,109.33 28.98,114.66 29.2,114.88 C21.1 | C21.1 41.02,124.01 41.02,128.02 41.63,128.63 43.48,128.63 44.07,128.05 C22.1 | C23.1 60.25,129.68 46.05,129.68 44.24,127.87 C22.1 | C23.1 63.49,128.68 77.83,128.68 78.07,128.44 C3.1 | C3.1 80.22,129.78 93.29,129.78 93.76,129.31 C4.1 | C4.1 95,129.4 108.71,129.4 110.57,131.25 112.09,131.25 112.32,131.02 C5.1 | C5.1 115.55,125.81 116.74,125.81 123.14,119.41 124.64,119.41 124.91,119.14 C6.1 | C6.1 132.66,109.03 132.66,105.24 134.52,103.39 134.52,102.45 134.11,102.04 C7.1 | C7.1 143.84,91.67 143.84,88.2 143.15,87.5 C8.1

## Text on the board
tPlace: Designed by James Yelland | LJ STAND | Lachlan Grant | James Yelland | James Wallington | Sam Tudor | Nakul Doshi | BRISBANE BOYS' COLLEGE | AUSTRALIA | 3.3V | GND | SCL | SDA | 5V | SDA | SCL | 1 | GND | 1
bPlace: 5V | 3.3V | LDR_IN | GND | GND | 1 | 3.3V | GND | TX | RX